# EasyEDA Pro project led_board.epro

# Schematic LED_board
Board Name: LED_board; Create Date: 2025-07-04; Page Name: P1; Project Name: metaball; Schematic Name: LED_board; Update Date: 2025-07-04; Company: 嘉立创EDA; Drawed: Xudong Han; Page Size: A4; Version: V1.0
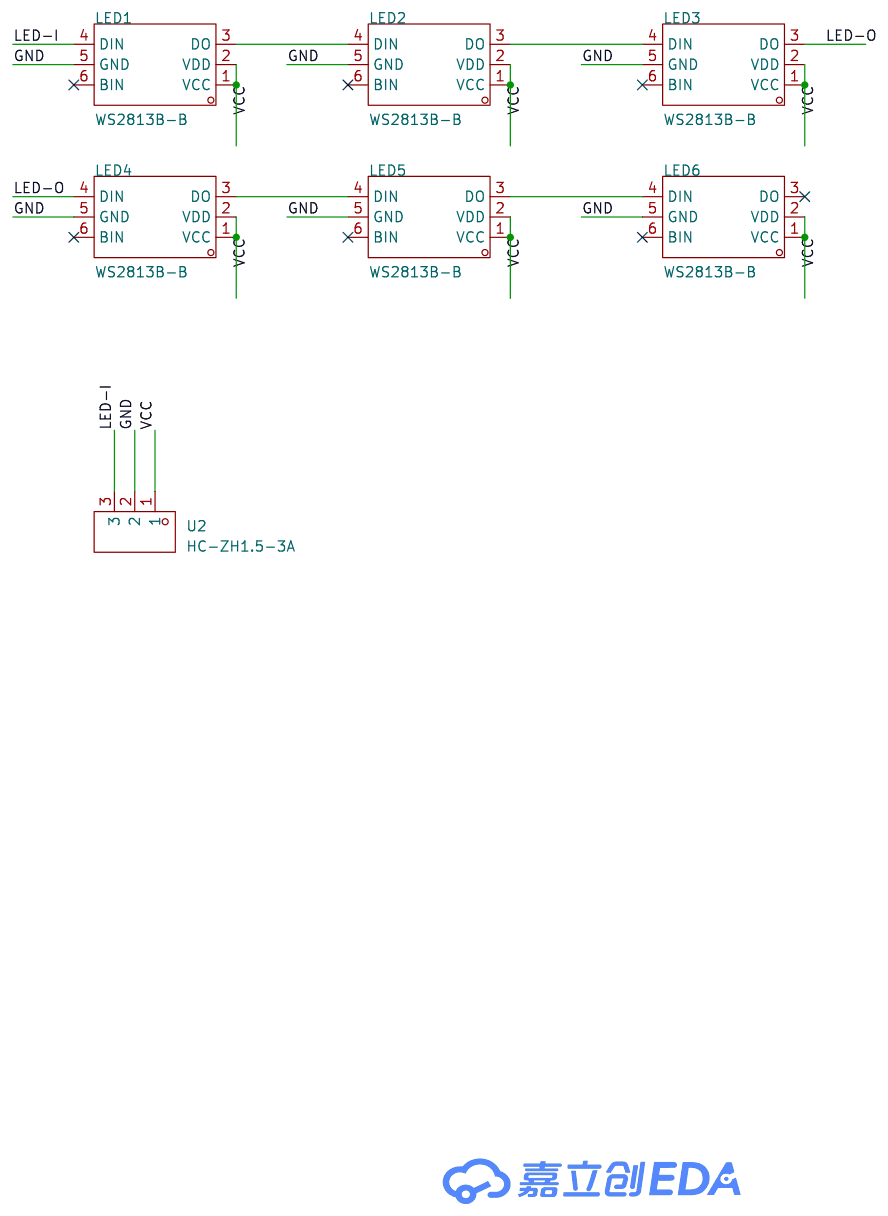
[diagram p0: schematic sheet]

## Parts
LED1  WS2813B-B  [LED-SMD_6P-L5.0-W5.0-TL]
LED2  WS2813B-B  [LED-SMD_6P-L5.0-W5.0-TL]
LED3  WS2813B-B  [LED-SMD_6P-L5.0-W5.0-TL]
LED4  WS2813B-B  [LED-SMD_6P-L5.0-W5.0-TL]
LED5  WS2813B-B  [LED-SMD_6P-L5.0-W5.0-TL]
LED6  WS2813B-B  [LED-SMD_6P-L5.0-W5.0-TL]
U2  HC-ZH1.5-3A  [CONN-TH_3P-P1.50_HCTL_HC-ZH1.5-3A]

## Library data of the parts
LED1-LED6 = WS2813B-B: 照明颜色:RGB三色;; LCSC Part Name: 5050RGB集成光源6Pin; Supplier Part: C5446704; Manufacturer: worldsemi; Supplier Footprint: SMD,5x5mm; JLCPCB Part Class: ExtendedPart; Datasheet: https://atta.szlcsc.com/upload/public/pdf/source/20180423/C114592_D58467098387A6353E1083E226191DBA.pdf; Supplier: LCSC; Mounting Type: TopView; Illumination Color: RGB三色
U2 = HC-ZH1.5-3A: 插针结构:1x3P;间距:1.5mm;安装方式:直插;参考系列:ZH;总PIN数:3P;排数:1;每排PIN数:3;行距:-;额定电流:1A;触头材质:黄铜;触头镀层:锡;工作温度范围:-25℃~+85℃;; LCSC Part Name: 1x3P 间距:1.5mm 直插 系列:ZH; Supplier Part: C2845551; Manufacturer: HCTL(华灿天禄); Supplier Footprint: 插件,P=1.5mm; JLCPCB Part Class: Extended Part; Datasheet: https://atta.szlcsc.com/upload/public/pdf/source/20230711/891FEA77A098E3B44CC72703EA57A8B8.pdf; Supplier: LCSC; Pins Structure: 1x3P; Pitch: 1.5mm; Mounting Style: 直插; Reference Series: ZH; Number of Pins: 3P; Number of Rows: 1; Number of PINs Per Row: 3; Current Rating (Max): 1A; Contact Material: 黄铜; Contact Plating: 锡; Operating Temperature Range: -25℃~+85℃; Rated Voltage (Max): 100V; Plastic Material: PBT; Flame Retardant Rating: UL94V-0; Z-Height of the Board: 4.5mm; X-Length of Bottom Edge on Board (Spacing Line): 6mm; Y-Width of Bottom Edge on Board: 3.6mm

## Nets
GND: LED1.5(GND) LED2.5(GND) LED3.5(GND) LED4.5(GND) LED5.5(GND) LED6.5(GND) U2.2
VCC: LED1.1(VCC) LED1.2(VDD) LED2.1(VCC) LED2.2(VDD) LED3.1(VCC) LED3.2(VDD) LED4.1(VCC) LED4.2(VDD) LED5.1(VCC) LED5.2(VDD) LED6.1(VCC) LED6.2(VDD) U2.1
LED-I: LED1.4(DIN) U2.3
LED-O: LED3.3(DO) LED4.4(DIN)
$1N334: LED1.3(DO) LED2.4(DIN)
$1N335: LED2.3(DO) LED3.4(DIN)
$1N348: LED4.3(DO) LED5.4(DIN)
$1N349: LED5.3(DO) LED6.4(DIN)

Not connected (* = marked no-connect by the designer): LED1 6(BIN)*; LED2 6(BIN)*; LED3 6(BIN)*; LED4 6(BIN)*; LED5 6(BIN)*; LED6 3(DO)* 6(BIN)*

# Board LED_board
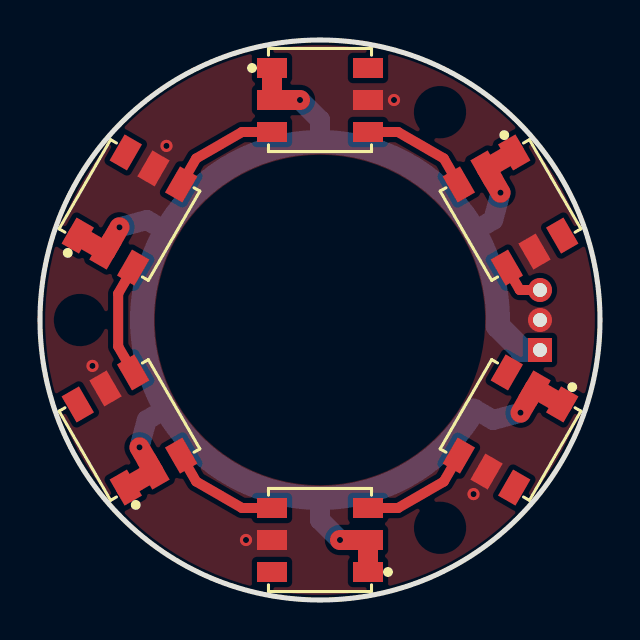
[diagram p1: board, top side]
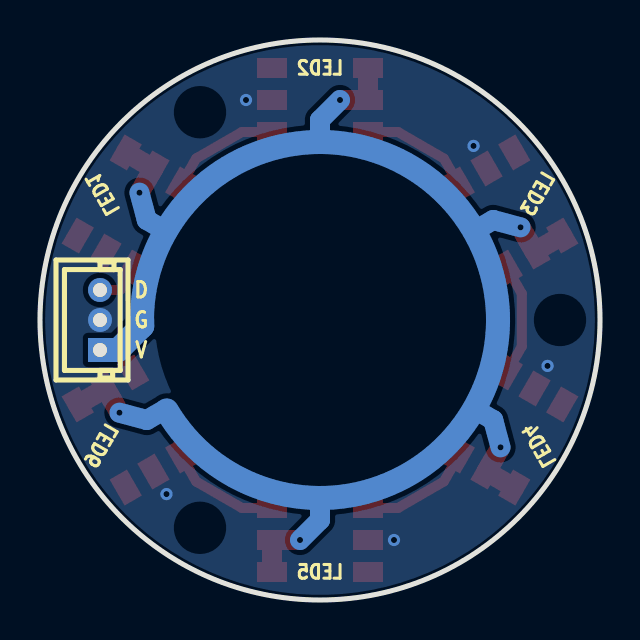
[diagram p2: board, bottom side, seen from below]

Outline 28 x 28 mm; copper layers: Top Layer, Bottom Layer. Coordinates in mm from the lower left corner of the outline.
Outline path: circle c14,14 r14
Stack: Top Layer 0.035mm / Dielectric1 1.51mm FR4 er 4.5 / Bottom Layer 0.035mm

## Design rules (mm)
template: 自定义配置
spacing copperThickness1oz (default): track to track 0.102, other pairs 0.152 to 0.3
spacing copperThickness2oz: track to track 0.203, other pairs 0.152 to 0.3
track width copperThickness1oz (default): min 0.127, default 0.254, max 2.54
track width copperThickness2oz: min 0.203, default 0.254, max 2.54
differential pair differentialPair (default): width min 0.127, default 0.254, max 2.54; gap min 0.152, default 0.152
via viaSize (default): diameter min 0.5, default 0.61, max 10; hole min 0.3, default 0.305, max 6.3

## Placement (name value [footprint] x y rotation side)
LED1  WS2813B-B  [LED-SMD_6P-L5.0-W5.0-TL]  23.53 19.5 300 top
LED2  WS2813B-B  [LED-SMD_6P-L5.0-W5.0-TL]  14 25 0 top
LED3  WS2813B-B  [LED-SMD_6P-L5.0-W5.0-TL]  4.47 19.5 60 top
LED4  WS2813B-B  [LED-SMD_6P-L5.0-W5.0-TL]  4.47 8.5 120 top
LED5  WS2813B-B  [LED-SMD_6P-L5.0-W5.0-TL]  14 3 180 top
LED6  WS2813B-B  [LED-SMD_6P-L5.0-W5.0-TL]  23.53 8.5 240 top
U2  HC-ZH1.5-3A  [CONN-TH_3P-P1.50_HCTL_HC-ZH1.5-3A]  25 14 90 bottom

## Footprints (pads in the part's own frame, mm; a bottom-side part is the same pattern mirrored in y, then rotated)
CONN-TH_3P-P1.50_HCTL_HC-ZH1.5-3A
  rect 1.2x1.2 hole 0.7: 1(-1.5,0)
  round 1.2 hole 0.7: 2(0,0) 3(1.5,0)
LED-SMD_6P-L5.0-W5.0-TL
  rect 1.5x1 smd: 1(-2.4,1.6) 2(-2.4,0) 3(-2.4,-1.6) 4(2.4,-1.6) 5(2.4,0) 6(2.4,1.6)

## Nets
As in the schematic.

Pads without a net: LED1 6; LED2 6; LED3 6; LED4 6; LED5 6; LED6 3 6

## Via types
v1: diameter 0.61, hole 0.305, Top Layer to Bottom Layer, 11 vias

## Routing (per net, layer and track width the routed paths; a pad name or vN(x,y) marks a point on that pad's centre or on a via; arc(x,y) is an arc through that point)
GND:
  vias: v1(2.62,11.7) v1(6.32,22.7) v1(10.3,3) v1(17.7,25) v1(21.68,5.3)
VCC: length 86.5
  Top Layer w1: v1(4.97,7.63) LED4.2 LED4.1 ; v1(3.97,18.63) LED3.2 LED3.1 ; v1(23.03,20.37) LED1.2 LED1.1 ; v1(24.03,9.37) LED6.2 LED6.1 ; v1(15,3) LED5.2 LED5.1 ; LED2.1 LED2.2 v1(13,25)
  Bottom Layer w1: 14,4.98 14,4 v1(15,3) ; 6.19,9.49 5.34,9 v1(4.97,7.63) ; 21.81,9.49 22.66,9 v1(24.03,9.37) ; 14,23.02 14,24 v1(13,25) ; 21.81,18.51 22.66,19 v1(23.03,20.37) ; v1(3.97,18.63) 5.34,19 6.19,18.51
  Bottom Layer w1.2: 21.66,9.48 arc(5.41,16.34) 22.9,14 ; U2.1 24.09,12.5 22.89,13.7 22.89,14
LED-I: length 2.3
  Top Layer w0.5: U2.3 23.99,15.5 LED1.4
LED-O: length 5.6
  Top Layer w0.5: LED3.3 3.91,15.32 3.91,12.68 LED4.4
$1N334: length 5.6
  Top Layer w0.5: LED1.3 20.19,22.08 17.9,23.4 LED2.4
$1N335: length 5.6
  Top Layer w0.5: LED2.3 10.1,23.4 7.81,22.08 LED3.4
$1N348: length 5.6
  Top Layer w0.5: LED4.3 7.81,5.92 10.1,4.6 LED5.4
$1N349: length 5.6
  Top Layer w0.5: LED6.4 20.19,5.92 17.9,4.6 LED5.3

## Copper pours and planes (outline as drawn; the poured copper is in the pictures)
GND on Top Layer: -4.03,30.38 29.75,30.38 29.75,-2.13 -4.03,-2.13
GND on Bottom Layer: -4.03,30.38 29.75,30.38 29.75,-2.13 -4.03,-2.13

## Text on the board
Bottom Silkscreen Layer: D | G | V
